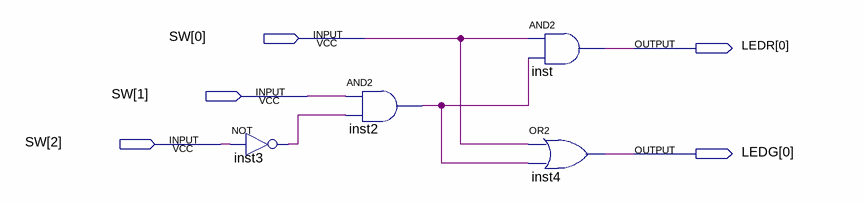
[diagram p0: schematic sheet]
// Quartus schematic labTest.bdf as structural Verilog: 4 symbols, 5 pins
module labTest (
  input  [2:0] SW,
  output [0:0] LEDR,
  output [0:0] LEDG
);

  wire inst2_out, inst3_out;

  not inst3 (inst3_out, SW[2]);
  and inst2 (inst2_out, SW[1], inst3_out);
  and inst (LEDR[0], SW[0], inst2_out);
  or inst4 (LEDG[0], SW[0], inst2_out);
endmodule
